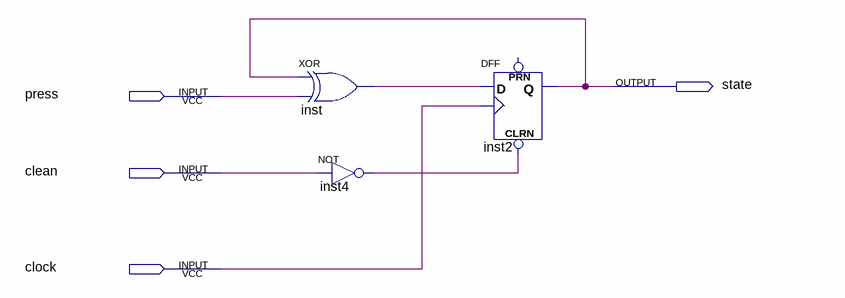
[diagram p0: schematic sheet]
// Quartus schematic seq_ckt.bdf as structural Verilog: 3 symbols, 4 pins
module seq_ckt (
  input  press,
  input  clean,
  input  clock,
  output state
);

  wire inst4_out, inst_out;

  xor inst (inst_out, state, press);
  not inst4 (inst4_out, clean);
  DFF inst2 (.CLRN(inst4_out), .CLK(clock), .D(inst_out), .Q(state));  // open: PRN
endmodule
